# EAGLE design XBee_v1 (EAGLE 6.1)
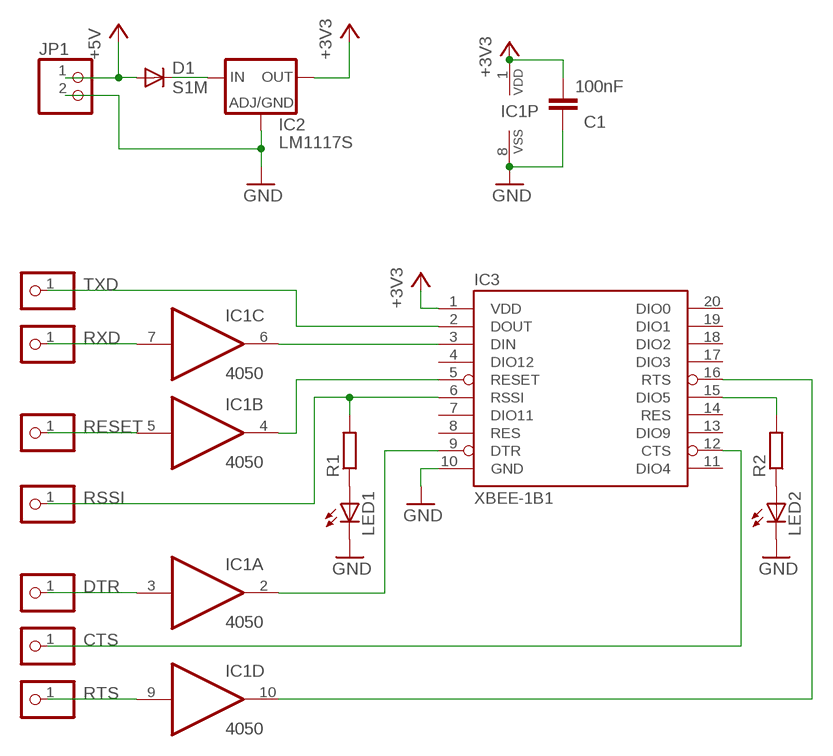
[diagram p0: schematic, sheet 1]

## Parts
C1  100nF  C-EUC0805K  [C0805K]
D1  S1M  [DO-214AC]
IC1  4050  4050D  [SO16]
IC2  LM1117S  [SOT223]
IC3  XBEE-1B1  [XBEE-1]
JP1  PINHD-1X2  [1X02]
JP2  TXD  PINHD-1X1  [1X01]
JP3  RXD  PINHD-1X1  [1X01]
JP4  RST  PINHD-1X1  [1X01]
JP5  RSSI  PINHD-1X1  [1X01]
JP6  DTR  PINHD-1X1  [1X01]
JP7  CTS  PINHD-1X1  [1X01]
JP8  RTS  PINHD-1X1  [1X01]
LED1  LED3MM  [LED3MM]
LED2  LED3MM  [LED3MM]
R1  R-EU_R0805  [R0805]
R2  R-EU_R0805  [R0805]

## Nets
+3V3: C1.2 IC1.1(P:VDD) IC2.2(OUT) IC2.4(OUT) IC3.1(VDD)
+5V: D1.A JP1.1
CTS: IC3.12(CTS) JP7.1
DTR: IC1.3(A:I) JP6.1
GND: C1.1 IC1.8(P:VSS) IC2.1(ADJ) IC3.10(GND) JP1.2 LED1.K(C) LED2.K(C)
N$1: D1.C IC2.3(IN)
N$3: IC1.6(C:O) IC3.3(DIN)
N$4: IC1.4(B:O) IC3.5(RESET)
N$6: LED1.A R1.1
N$7: IC1.2(A:O) IC3.9(DTR)
N$8: IC1.10(D:O) IC3.16(RTS)
N$9: LED2.A R2.1
N$10: IC3.15(DIO5) R2.2
RESET: IC1.5(B:I) JP4.1
RSSI: IC3.6(RSSI) JP5.1 R1.2
RTS: IC1.9(D:I) JP8.1
RXD: IC1.7(C:I) JP3.1
TXD: IC3.2(DOUT) JP2.1
Unconnected: IC1.11(E:I) IC1.12(E:O) IC1.14(F:I) IC1.15(F:O) IC3.4(DIO12) IC3.7(DIO11) IC3.8(RES) IC3.11(DIO4) IC3.13(DIO9) IC3.14(RES) IC3.17(DIO3) IC3.18(DIO2) IC3.19(DIO1) IC3.20(DIO0)

## Library data of the parts
C1 = mark_1:C-EU: CAPACITOR, European symbol
D1 = mark_1:S1M
IC1 = mark_1:4050: Hex non-inverting BUFFER
IC2 = mark_1:LM1117: Low drop fixed and adjustable positive voltage regulators 1 A Source: http://www.st.com/stonline/products/literature/ds/7194/ld1117axx.pdf
IC3 = mark_1:XBEE-1
JP1 = mark_1:PINHD-1X2: PIN HEADER
JP2-JP8 = mark_1:PINHD-1X1: PIN HEADER
LED1 LED2 = mark_1:LED
R1 R2 = mark_1:R-EU_: RESISTOR, European symbol

## Board
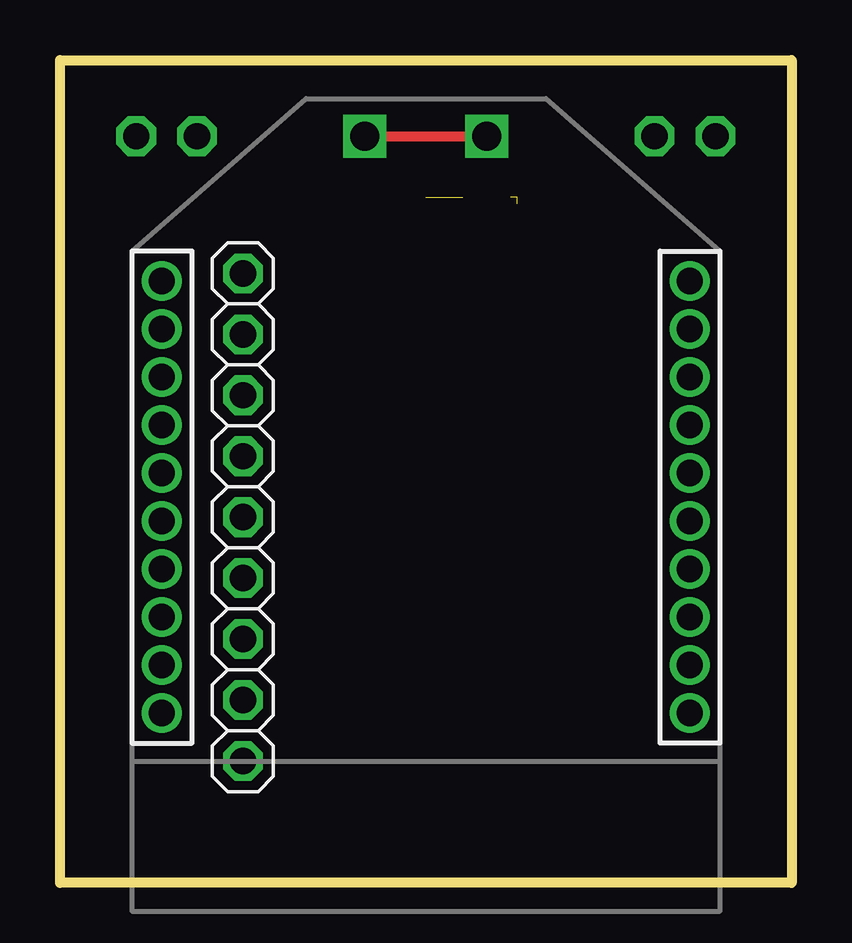
[diagram p1: board, top side]
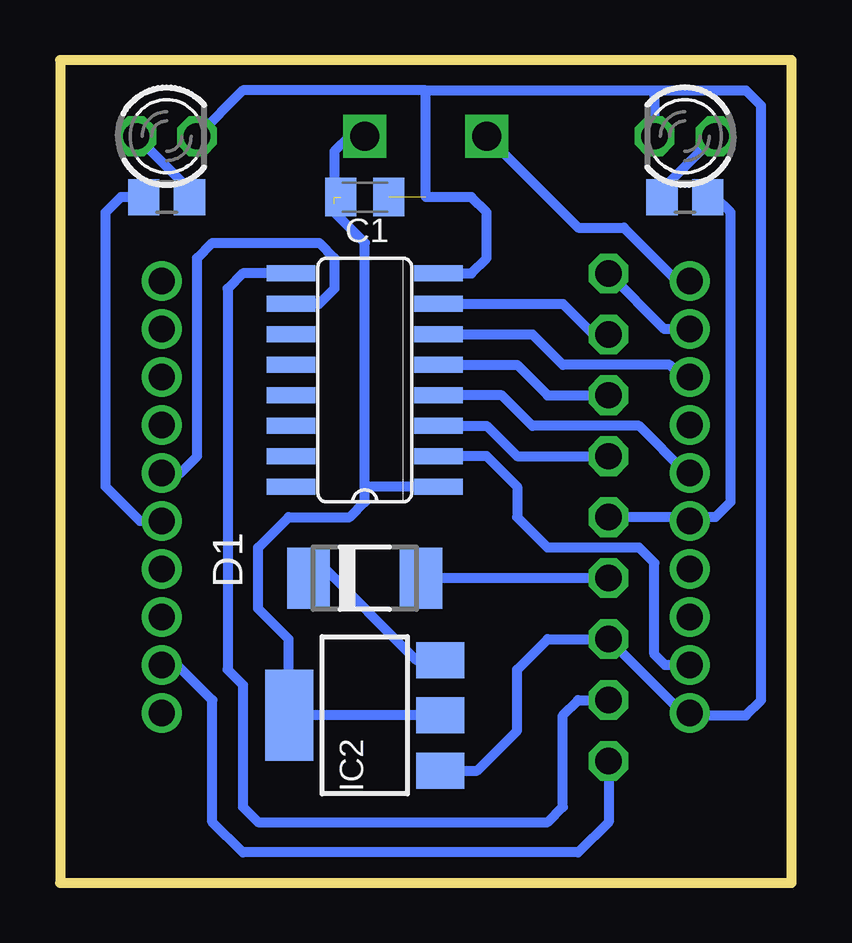
[diagram p2: board, bottom side, seen from below]

Size 30.48 x 34.29 mm. Coordinates in mm from the lower left corner, seen from the top.
Outline: 0,0 0,34.29 30.48,34.29 30.48,0 0,0
Copper layers (1*16): Top 0.035mm / dielectric 1.5mm / Bottom 0.035mm
Design rules: minimum track width 10mil, minimum drill 24mil, track to track 8mil, track to pad 8mil, pad to pad 8mil, via to via 8mil, smd to smd 8mil, copper to edge 40mil, drill to drill 8mil, minimum pad ring 10mil, minimum via ring 8mil, stop-mask expansion 4mil, vias tented up to drill 0mil, thermal gap 10mil

### Footprints (pad centres in the part's own frame; a part is rotated, then mirrored left to right if it is on the bottom)
C0805K = smd 1.3 x 1.6: 1 -1,0; 2 1,0
DO-214AC = smd 1.778 x 2.54: A 2.342,0; C -2.342,0
SO16 = smd 0.66 x 2.032: 1 -4.445,-3.073; 2 -3.175,-3.073; 3 -1.905,-3.073; 4 -0.635,-3.073; 5 0.635,-3.073; 6 1.905,-3.073; 7 3.175,-3.073; 8 4.445,-3.073; 9 4.445,3.073; 10 3.175,3.073; 11 1.905,3.073; 12 0.635,3.073; 13 -0.635,3.073; 14 -1.905,3.073; 15 -3.175,3.073; 16 -4.445,3.073
SOT223 = smd 1.5 x 2: 1 -2.3,-3.15; 2 0,-3.15; 3 2.3,-3.15 | smd 3.8 x 2: 4 0,3.15
XBEE-1 = drill 1.1: 1 -11,20; 2 -11,18; 3 -11,16; 4 -11,14; 5 -11,12; 6 -11,10; 7 -11,8; 8 -11,6; 9 -11,4; 10 -11,2; 11 11,2; 12 11,4; 13 11,6; 14 11,8; 15 11,10; 16 11,12; 17 11,14; 18 11,16; 19 11,18; 20 11,20
1X02 = drill 1.1 octagon: 1 -1.27,0; 2 1.27,0
1X01 = drill 1.1 octagon: 1 0,0
LED3MM = drill 1.1 octagon: A -1.27,0; K 1.27,0
R0805 = smd 1.3 x 1.5: 1 -0.95,0; 2 0.95,0

### Placement (x,y rotation side)
C1  17.78,28.57 180 bottom
D1  17.78,12.7 0 bottom
IC1  17.78,20.95 90 bottom
IC2  LM1117-3.3  [SOT223]  17.78,6.99 90 bottom
IC3  15.24,5.08 0 top
JP1  7.62,11.43 270 top
JP2  7.62,25.4 270 top
JP3  7.62,22.86 270 top
JP4  7.62,20.32 270 top
JP5  7.62,15.24 0 top
JP6  7.62,17.78 270 top
JP7  7.62,5.08 90 top
JP8  7.62,7.62 270 top
LED1  4.45,31.11 180 bottom
LED2  26.04,31.11 0 bottom
R1  4.45,28.57 0 bottom
R2  26.04,28.57 180 bottom

### Tracks (layer width: path | path; a pad name or v marks a point on that pad's centre or on a via)
+3V3  (via drill 1.2)  (2 unrouted)
  Top 0.406: v12.7,31.11 v17.78,31.11
  Bottom 0.406: 21.59,7.62 20.95,7.62 | 20.95,7.62 IC2.4 IC2.2 | 20.95,7.62 20.95,10.16 22.23,11.43 22.23,13.97 20.95,15.24 18.41,15.24 17.78,15.88 17.78,16.51 | IC1.1 17.78,16.51 | 17.78,16.51 17.78,26.67 19.05,27.94 19.05,28.3 | IC3.1 4.76,25.08 6.99,27.3 8.89,27.3 v12.7,31.11 | v17.78,31.11 18.41,31.11 19.05,30.48 19.05,28.57
+5V
  Bottom 0.406: JP1.1 D1.A
CTS
  Bottom 0.406: JP7.1 7.62,2.54 8.89,1.27 22.86,1.27 24.13,2.54 24.13,7.62 25.59,9.08 IC3.12
DTR
  Bottom 0.406: IC1.3 12.7,19.05 11.43,17.78 JP6.1
GND  (1 unrouted)
  Bottom 0.254: 15.24,25.4 IC1.8
  Bottom 0.406: IC3.10 4.54,7.08 | IC2.1 13.1,4.68 11.43,6.35 11.43,8.89 10.16,10.16 JP1.2 4.54,7.08 | 4.54,7.08 4.45,6.99 1.91,6.99 1.27,7.62 1.27,32.38 1.91,33.02 5.71,33.02 | 15.24,33.02 15.24,28.57 13.34,28.57 12.7,27.94 12.7,26.04 13.34,25.4 15.24,25.4 | 15.24,33.02 5.71,33.02 | 15.24,33.02 22.86,33.02 LED2.K | 5.71,33.02 LED1.K
N$1
  Bottom 0.406: IC2.3 15.63,9.29 19.68,13.34 D1.C
N$3
  Bottom 0.406: IC1.6 10.79,22.86 9.53,21.59 5.08,21.59 4.57,21.08 IC3.3
N$4
  Bottom 0.406: IC3.5 4.38,17.08 6.35,19.05 10.79,19.05 12.06,20.32 IC1.4
N$6
  Bottom 0.406: R1.1 5.39,28.89 LED1.A
N$7
  Bottom 0.406: 15.24,17.78 IC1.2 12.7,17.78 11.43,16.51 11.43,15.24 10.16,13.97 6.35,13.97 5.71,13.34 5.71,9.53 5.27,9.08 IC3.9
N$8
  Bottom 0.406: IC3.16 25.46,17.08 24.77,17.78 24.77,26.04 24.13,26.67 19.68,26.67 19.05,26.04 19.05,24.77 19.68,24.13 IC1.10
N$9
  Bottom 0.406: R2.1 25.09,28.89 LED2.A
N$10
  Bottom 0.406: IC3.15 27.14,15.08 28.57,16.51 28.57,27.94 27.94,28.57 R2.2
RESET
  Bottom 0.406: IC1.5 11.43,21.59 10.16,20.32 JP4.1
RSSI
  Bottom 0.406: 4.45,15.24 3.17,15.24 2.54,15.88 2.54,27.94 3.17,28.57 R1.2 | 4.45,15.24 JP5.1 | IC3.6 4.29,15.08 4.45,15.24
RTS
  Bottom 0.406: IC1.9 22.86,25.4 23.5,24.77 23.5,8.89 22.86,8.26 22.86,3.17 22.23,2.54 10.16,2.54 9.53,3.17 9.53,6.99 8.89,7.62 JP8.1
RXD
  Bottom 0.406: IC1.7 9.53,24.13 8.26,22.86 JP3.1
TXD
  Bottom 0.406: IC3.2 5.3,23.08 JP2.1

### Text on the board
tValues: VCC | GND